# Altium schematic sheet BC28-NBIOT-V0.2.schdoc
size A2
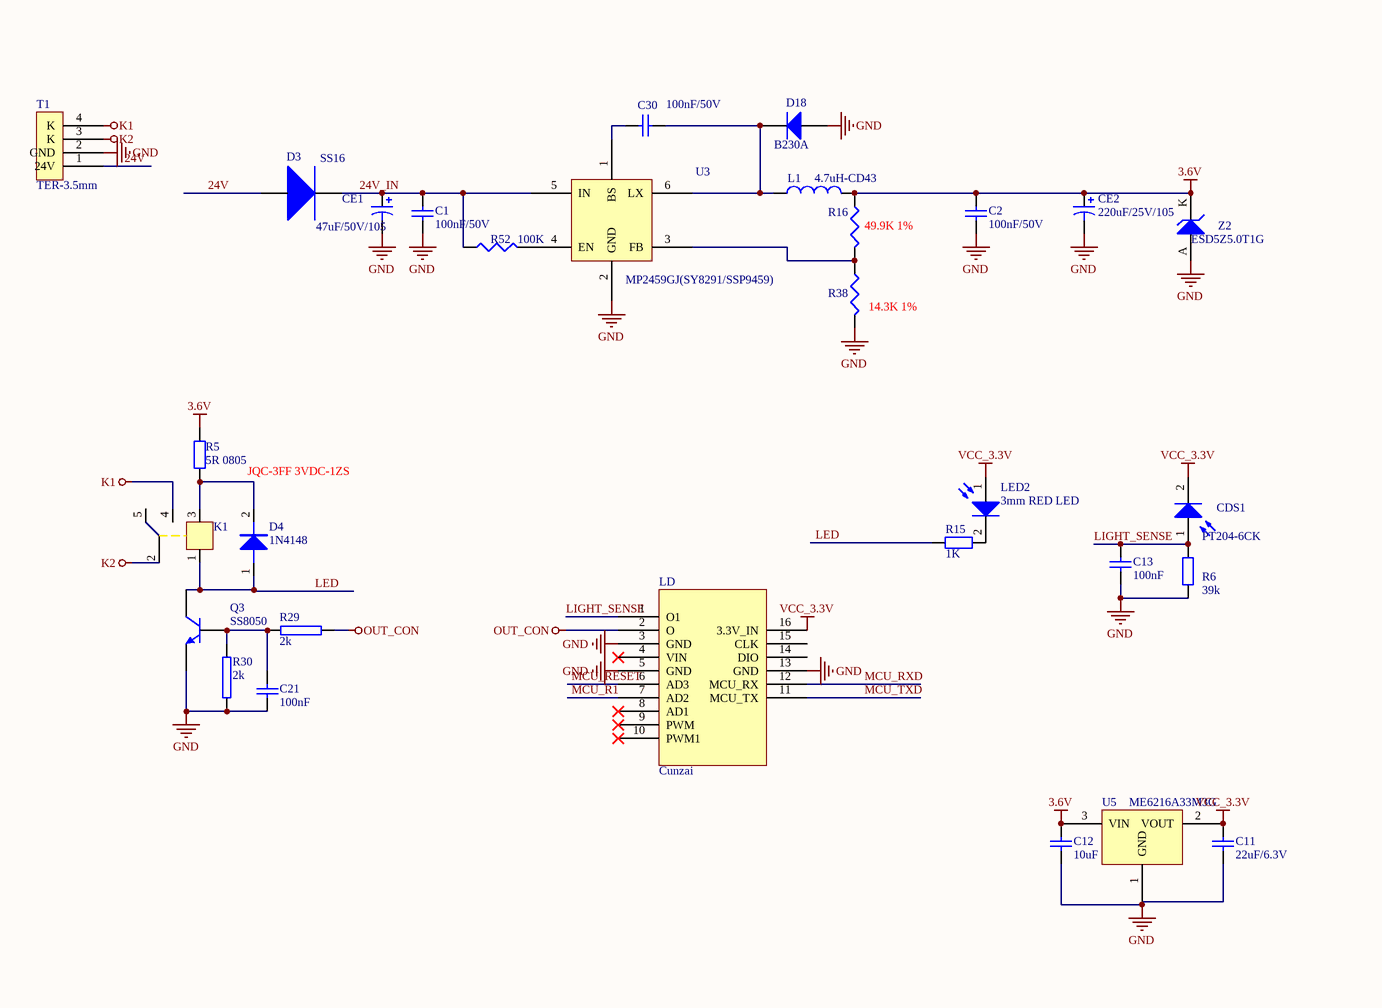
[diagram p0: BC28-NBIOT-V0.2.schdoc, left]
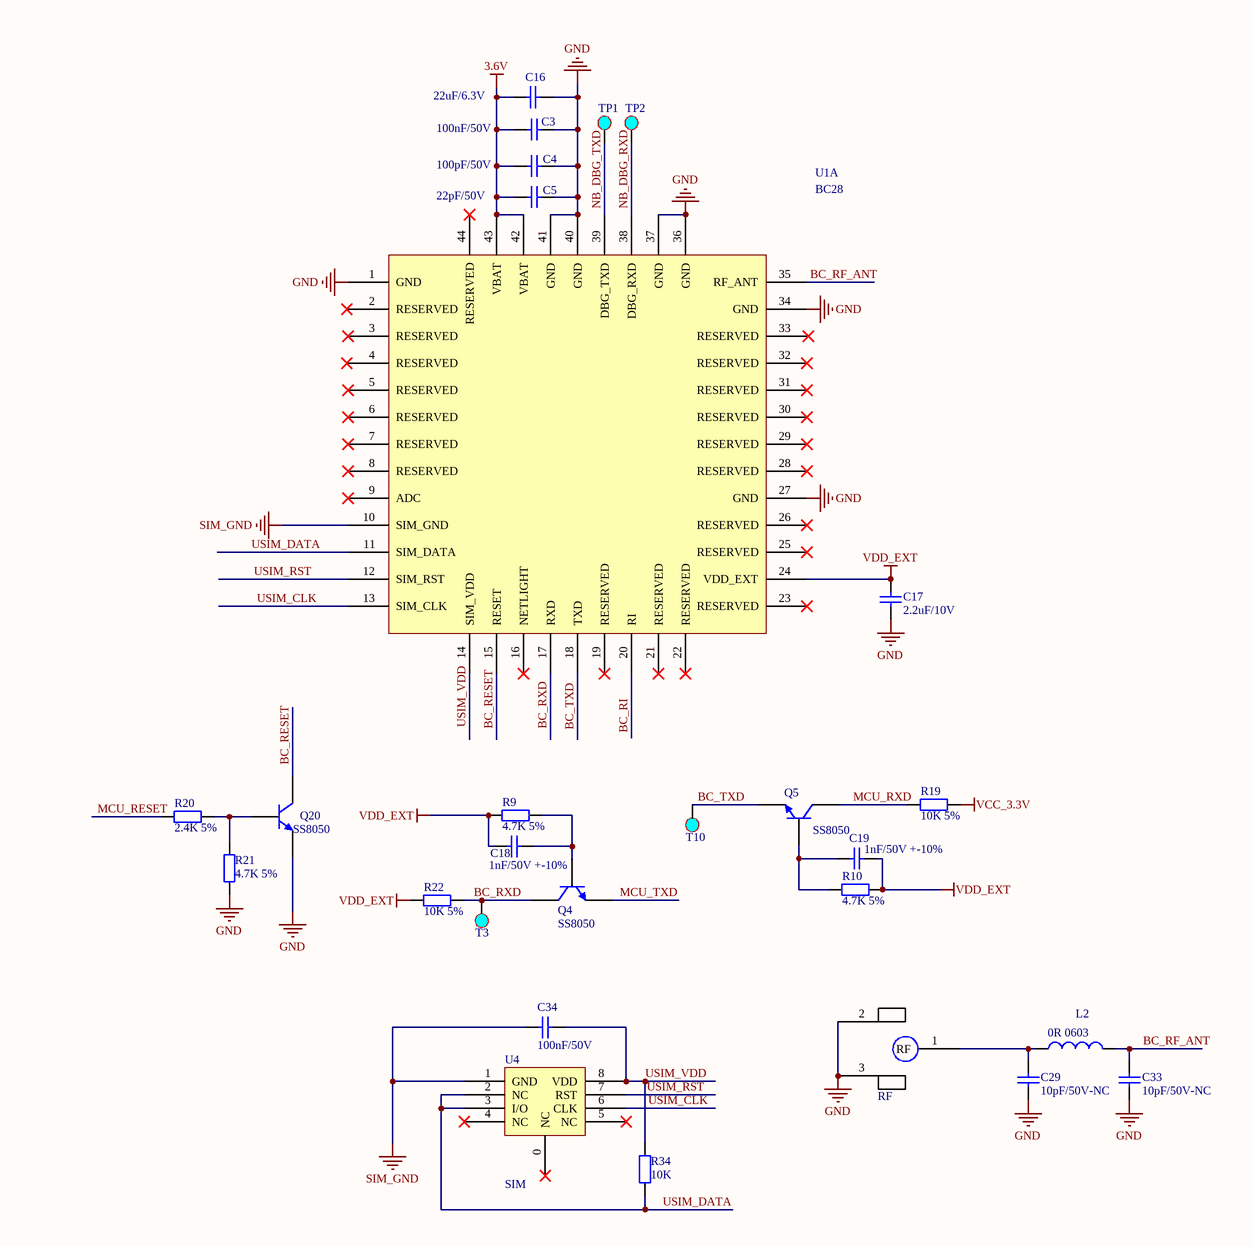
[diagram p1: BC28-NBIOT-V0.2.schdoc, right]

## Parts
C1  100nF/50V  [0603]
C2  100nF/50V  [0603]
C3  100nF/50V  [0603]
C4  100pF/50V  [0603]
C5  22pF/50V  [0603]
C11  22uF/6.3V  [0603]
C12  10uF  [0603]
C13  100nF  [C0603]
C16  22uF/6.3V  [0603]
C17  2.2uF/10V  [C0603]
C18  1nF/50V +-10%  [0603]
C19  1nF/50V +-10%  [0603]
C21  100nF  [C0603]
C29  10pF/50V-NC  [0603]
C30  100nF/50V  [0603]
C33  10pF/50V-NC  [0603]
C34  100nF/50V  [0603]
CDS1  PT204-6CK  [LED-3MM]
CE1  47uF/50V/105  [DIPC6X12]
CE2  220uF/25V/105  [DIPC6X12]
D3  SS16  [SMA]
D4  1N4148  [SOD123]
D18  B230A  [SMA]
K1  JQC-3FF 3VDC-1ZS  [JQC-3FF]
L1  4.7uH-CD43  [CDRH3D16]
L2  0R 0603  [0603]
LD  Cunzai  [CUNZAI_816]
LED2  3mm RED LED  [LED-3MM]
Q3  SS8050  [SOT-23]
Q4  SS8050  [SOT-23]
Q5  SS8050  [SOT-23]
Q20  SS8050  [SOT-23]
R5  value 5R 0805  [0805]  (hidden comment: Res2)
R6  value 39k  [R0603]  (hidden comment: Res2)
R9  4.7K 5%  [R0603]
R10  4.7K 5%  [R0603]
R15  value 1K  [R0603]  (hidden comment: Res2)
R16  49.9K 1%  [0603]
R19  10K 5%  [R0603]
R20  2.4K 5%  [R0603]
R21  4.7K 5%  [R0603]
R22  10K 5%  [R0603]
R29  2k  [SR0603]
R30  2k  [SR0603]
R34  10K  [R0603]
R38  14.3K 1%  [0603]
R52  100K  [0603]
RF  RF_SMD  [UFL]  (value not drawn)
T1  TER-3.5mm  [4-KKK]
T3  (no value)  [TestPoints]
T10  (no value)  [TestPoints]
TP1  (no value)  [TestPoints]
TP2  (no value)  [TestPoints]
U1  BC28  [BC28]  (part A of 2)
U3  MP2459GJ(SY8291/SSP9459)  [SOT23-6]
U4  SIM  [DFN8]
U5  ME6216A33M3G  [SOT-23]
Z2  ESD5Z5.0T1G  [SOD323]

## Nets
3.6V: C2.2 C3.2 C4.2 C5.2 C12.1 C16.1 CE2.1 L1.2 R5.1 R16.1 U1.42(VBAT) U1.43(VBAT) U5.3(VIN) Z2.K
GND: C1.1 C2.1 C3.1 C4.1 C5.1 C11.2 C12.2 C13.1 C16.2 C17.2 C21.2 C29.1 C33.1 CE1.2 CE2.2 D18.1(A) LD.3(GND) LD.5(GND) LD.13(GND) Q3.2(E) Q20.2(E) R6.1 R21.1 R30.1 R38.2 RF.2(GND) RF.3(GND) T1.2(GND) U1.1(GND) U1.27(GND) U1.34(GND) U1.36(GND) U1.37(GND) U1.40(GND) U1.41(GND) U3.2(GND) U5.1(GND) Z2.A
K1: K1.4 T1.4(K)
K2: K1.2 T1.3(K)
OUT_CON: LD.2(O) R29.2
SIM_GND: C34.2 U1.10(SIM_GND) U4.1(GND)
VCC_3.3V: C11.1 CDS1.2(K) LD.16(3.3V_IN) R19.1 U5.2(VOUT)
VDD_EXT: C17.1 C18.2 C19.2 R9.1 R10.1 R22.1 U1.24(VDD_EXT)
24V: D3.1(B) T1.1(24V)
24V_IN: C1.2 CE1.1 D3.2(C) R52.1 U3.5(IN)
BC_RESET: Q20.3(C) U1.15(RESET)
BC_RF_ANT: C33.2 L2.1 U1.35(RF_ANT)
BC_RI: U1.20(RI)
BC_RXD: Q4.3(C) R22.2 T3.1 U1.17(RXD)
BC_TXD: Q5.2(E) T10.1 U1.18(TXD)
LED: D4.1 K1.1 Q3.3(C) R15.2
LIGHT_SENSE: C13.2 CDS1.1(A) LD.1(O1) R6.2
MCU_R1: LD.7(AD2)
MCU_RESET: LD.6(AD3) R20.1
MCU_RXD: LD.12(MCU_RX) Q5.3(C) R19.2
MCU_TXD: LD.11(MCU_TX) Q4.2(E)
NB_DBG_RXD: TP2.1 U1.38(DBG_RXD)
NB_DBG_TXD: TP1.1 U1.39(DBG_TXD)
USIM_CLK: U1.13(SIM_CLK) U4.6(CLK)
USIM_DATA: R34.2 U1.11(SIM_DATA) U4.2(NC) U4.3(I/O)
USIM_RST: U1.12(SIM_RST) U4.7(RST)
USIM_VDD: C34.1 R34.1 U1.14(SIM_VDD) U4.8(VDD)
NetC18_1: C18.1 Q4.1(B) R9.2
NetC19_1: C19.1 Q5.1(B) R10.2
NetC21_1: C21.1 Q3.1(B) R29.1 R30.2
NetC29_2: C29.2 L2.2 RF.1(RF)
NetC30_1: C30.1 D18.2(K) L1.1 U3.6(LX)
NetC30_2: C30.2 U3.1(BS)
NetD4_2: D4.2 K1.3 R5.2
NetLED2_2: LED2.2(K) R15.1
NetQ20_1: Q20.1(B) R20.2 R21.2
NetR16_2: R16.2 R38.1 U3.3(FB)
NetR52_2: R52.2 U3.4(EN)

Not connected (* = marked no-connect by the designer): K1 5; LD 4(VIN)* 8(AD1)* 9(PWM)* 10(PWM1)* 14(DIO) 15(CLK); LED2 1(A); U1 2(RESERVED) 3(RESERVED)* 4(RESERVED) 5(RESERVED)* 6(RESERVED)* 7(RESERVED)* 8(RESERVED)* 9(ADC)* 16(NETLIGHT)* 19(RESERVED)* 21(RESERVED)* 22(RESERVED)* 23(RESERVED)* 25(RESERVED)* 26(RESERVED)* 28(RESERVED)* 29(RESERVED)* 30(RESERVED)* 31(RESERVED)* 32(RESERVED)* 33(RESERVED) 44(RESERVED)*; U4 0(NC)* 4(NC)* 5(NC)*

## Notes on the sheet
- Labels drawn without touching a wire or pin: VCC_3.3V

## Library data of the parts
C1-C5 C16 C18 C19 C29 C30 C33 C34 = Cap Semi: Capacitor (Semiconductor SIM Model); Published: 8-Jun-2000; LatestRevisionDate: 29-May-2009; LatestRevisionNote: IPC-7351 Footprint Added.; PackageReference: C1206; Publisher: Altium Limited; PackageDescription: Chip Capacitor
  C1-C3 C30 C34: Value: 100nF/50V
  C4: Value: 100pF/50V
  C5: Value: 22pF/50V
  C16: Value: 22uF/6.3V
  C18 C19: Value: 1nF/50V +-10%
  C29 C33: Value: 10pF/50V-NC
C11-C13 C17 C21 = Cap: Capacitor; Published: 8-Jun-2000; LatestRevisionDate: 17-Jul-2002; LatestRevisionNote: Re-released for DXP Platform.; PackageReference: RAD-0.3; Publisher: Altium Limited; PackageDescription: Radial Cap, Thru-Hole; 2 Leads; 0.3 in Pin Spacing
  C11: Value: 22uF/6.3V
  C12: Value: 10uF
  C13 C21: Value: 100nF
  C17: Value: 2.2uF/10V
CDS1 LED2 = Photo Sen: Photosensitive Diode; Published: 24-Mar-1999; LatestRevisionDate: 17-Jul-2002; LatestRevisionNote: Re-released for DXP Platform.; PackageReference: PIN2; Publisher: Altium Limited
  CDS1: Value: PT204-6CK
  LED2: Value: 3mm RED LED
CE1 CE2 = Cap Pol1: Polarized Capacitor (Radial); Published: 8-Jun-2000; LatestRevisionDate: 17-Jul-2002; LatestRevisionNote: Re-released for DXP Platform.; PackageReference: RB7.6-15; Publisher: Altium Limited
  CE1: Value: 47uF/50V/105
  CE2: Value: 220uF/25V/105
D3 = SS14: Value: SS16
D4 = DIODE
D18 = Diode 1N4007: 1 Amp General Purpose Rectifier; Revision 1: 11-Jul-2000: SIM Model Added.; Revision 2: 17-Jul-2002: Re-released for DXP Platform.; Package Information: Latest Revision: Aug-1999; Code - JEDEC: DO-204-AL; Published: 8-Jun-2000; Datasheet: Latest Revision: 1998; Package Reference: DO-41; Publisher: Altium Limited; Value: B230A
K1 = JDQ
L1 L2 = Inductor: Code_IEC: 1005; Published: 8-Jun-2000; PackageReference: 0402-A; Publisher: Altium Limited; Code_JEITA: 0402
  L1: LatestRevisionDate: 17-Jul-2002; LatestRevisionNote: Re-released for DXP Platform.; Value: 4.7uH-CD43
  L2: LatestRevisionDate: 29-May-2009; LatestRevisionNote: IPC-7351 Footprint Added.; PackageDescription: Chip Inductor; Value: 0R 0603
Q3-Q5 Q20 = S9014
R5 R6 R9 R10 R15 R19-R22 R34 = Res2: Resistor; Published: 8-Jun-2000; LatestRevisionDate: 17-Jul-2002; LatestRevisionNote: Re-released for DXP Platform.; PackageReference: AXIAL-0.4; Publisher: Altium Limited; PackageDescription: Axial Device, Thru-Hole; 2 Leads; 0.4 in Pin Spacing
  R9 R10 R21: Value: 4.7K 5%
  R19 R22: Value: 10K 5%
  R20: Value: 2.4K 5%
  R34: Value: 10K
R16 R38 R52 = Res3: Resistor; Published: 8-Jun-2000; Revision: July-2002: Re-released for DXP Platform.; Publisher: Altium Limited
  R16: Value: 49.9K 1%
  R38: Value: 14.3K 1%
  R52: Value: 100K
R29 R30 = RES
T3 T10 TP1 TP2 = TestPoints
U3 = SY8120B: Value: MP2459GJ(SY8291/SSP9459)
U5 = SSP6206
Z2 = D Zener: Zener Diode; Published: 8-Jun-2000; LatestRevisionDate: 17-Jul-2002; LatestRevisionNote: Re-released for DXP Platform.; PackageReference: DIODE-0.7; Publisher: Altium Limited; PackageDescription: Diode, Thru-Hole; 2 Leads; 0.7 in Pin Spacing